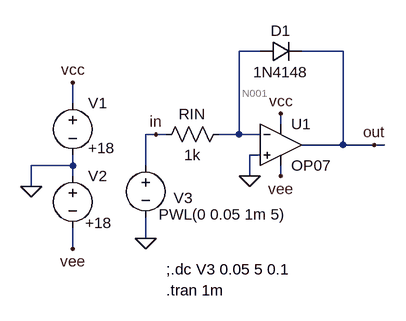
[diagram p0: schematic 15-logarithmic.asc]
15-logarithmic.asc, the LTspice schematic file:
Version 4
SHEET 1 880 680
WIRE 160 -64 128 -64
WIRE 288 -64 224 -64
WIRE -128 16 -128 -16
WIRE 192 48 192 32
WIRE 0 64 -16 64
WIRE 16 64 0 64
WIRE 128 64 128 -64
WIRE 128 64 96 64
WIRE 160 64 128 64
WIRE 288 80 288 -64
WIRE 288 80 224 80
WIRE 336 80 288 80
WIRE 352 80 336 80
WIRE 160 96 144 96
WIRE -128 112 -128 96
WIRE -128 112 -192 112
WIRE -16 112 -16 64
WIRE -128 128 -128 112
WIRE 144 128 144 96
WIRE 192 128 192 112
WIRE -192 144 -192 112
WIRE -16 224 -16 192
WIRE -128 240 -128 208
FLAG -192 144 0
FLAG -128 -16 vcc
FLAG -128 240 vee
FLAG -16 224 0
FLAG 0 64 in
FLAG 192 128 vee
FLAG 192 32 vcc
FLAG 336 80 out
FLAG 144 128 0
SYMBOL OpAmps\\OP07 192 16 R0
SYMATTR InstName U1
SYMBOL voltage -128 0 R0
WINDOW 3 24 85 Left 2
WINDOW 123 0 0 Left 0
WINDOW 39 0 0 Left 0
SYMATTR Value +18
SYMATTR InstName V1
SYMBOL voltage -128 112 R0
WINDOW 3 19 88 Left 2
WINDOW 123 0 0 Left 0
WINDOW 39 0 0 Left 0
SYMATTR Value +18
SYMATTR InstName V2
SYMBOL voltage -16 96 R0
WINDOW 0 43 66 Left 2
WINDOW 3 20 91 Left 2
WINDOW 123 0 0 Left 0
WINDOW 39 0 0 Left 0
SYMATTR InstName V3
SYMATTR Value PWL(0 0.05 1m 5)
SYMBOL res 112 48 R90
WINDOW 0 0 56 VBottom 2
WINDOW 3 32 56 VTop 2
SYMATTR InstName RIN
SYMATTR Value 1k
SYMBOL diode 160 -48 R270
WINDOW 0 32 32 VTop 2
WINDOW 3 0 32 VBottom 2
SYMATTR InstName D1
SYMATTR Value 1N4148
TEXT 16 272 Left 2 !;.dc V3 0.05 5 0.1
TEXT 16 304 Left 2 !.tran 1m

The netlist it stands for:
* 15-logarithmic.asc
XU1 0 N001 vcc vee out LT1001  ; OP07, pins In+ In- V+ V- OUT
V1 vcc 0 +18
V2 0 vee +18
V3 in 0 PWL(0 0.05 1m 5)
RIN N001 in 1k
D1 N001 out 1N4148
.model D D
.lib standard.dio
;.dc V3 0.05 5 0.1
.tran 1m
.lib LTC.lib
.backanno
.end

* Results of the author's LTspice run, read from the files saved beside the schematic
* Operating Point, zero values left out:
*   V(n001) = 603.1 nV
*   V(vcc) = 18 V
*   V(vee) = -18 V
*   V(out) = -448.5 mV
*   V(in) = 50 mV
*   I(D1) = 50 µA
*   I(Rin) = -50 µA
*   I(V3) = -50 µA
*   I(V2) = -2.275 mA
*   I(V1) = -2.225 mA
*   Ix(u1:3) = 2.225 mA
*   Ix(u1:4) = -2.275 mA
*   Ix(u1:5) = 50 µA
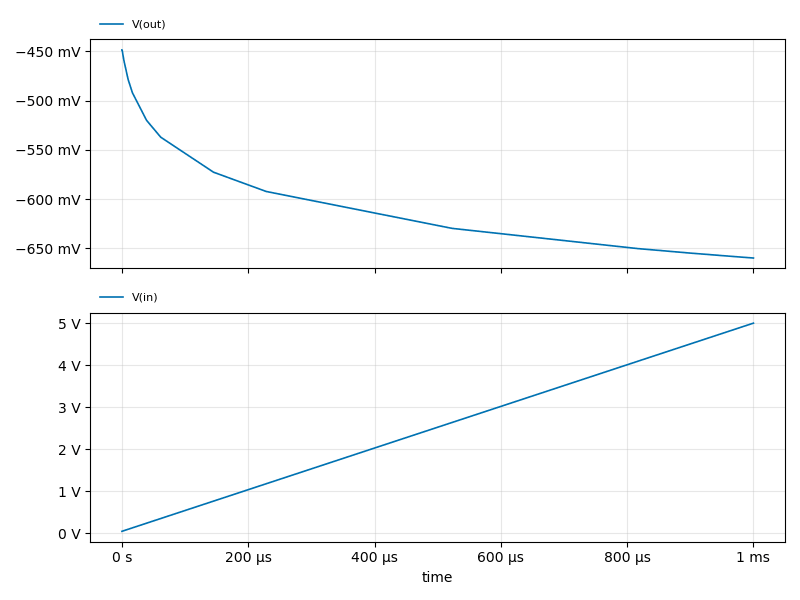
[diagram p1: Transient Analysis of 15-logarithmic.asc, plotted from the saved traces]
* Transient Analysis, 1 run:
*   V(out): min -659.9 mV, max -448.4 mV, average -614.1 mV, rms 615.6 mV, last -659.9 mV
*   V(in): min 50 mV, max 5 V, average 2.525 V, rms 2.939 V, last 5 V